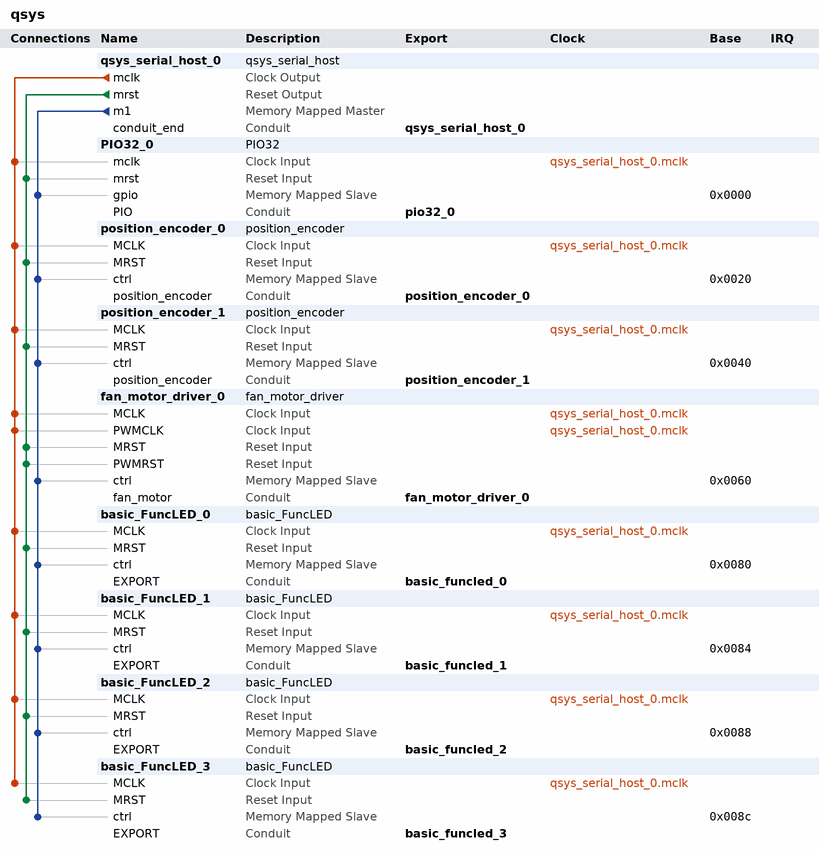
[diagram p0: system contents]
# Platform Designer (Qsys) system qsys, MAX II EPM1270T144C5
# Parameters at their usual value, and those the tool derives, are not listed.
package require qsys
create_system qsys
set_project_property DEVICE_FAMILY {MAX II}
set_project_property DEVICE EPM1270T144C5

add_instance qsys_serial_host_0 qsys_serial_host 1.0
set_instance_parameter_value qsys_serial_host_0 initial_state 0

add_instance PIO32_0 PIO32 1.0

add_instance position_encoder_0 position_encoder 1.0

add_instance position_encoder_1 position_encoder 1.0

add_instance fan_motor_driver_0 fan_motor_driver 1.0

add_instance basic_FuncLED_0 basic_FuncLED 1.0

add_instance basic_FuncLED_1 basic_FuncLED 1.0

add_instance basic_FuncLED_2 basic_FuncLED 1.0

add_instance basic_FuncLED_3 basic_FuncLED 1.0

# connections
add_connection qsys_serial_host_0.mclk basic_FuncLED_0.MCLK clock
add_connection qsys_serial_host_0.mclk basic_FuncLED_1.MCLK clock
add_connection qsys_serial_host_0.mclk basic_FuncLED_2.MCLK clock
add_connection qsys_serial_host_0.mclk basic_FuncLED_3.MCLK clock
add_connection qsys_serial_host_0.mclk fan_motor_driver_0.MCLK clock
add_connection qsys_serial_host_0.mclk fan_motor_driver_0.PWMCLK clock
add_connection qsys_serial_host_0.mclk PIO32_0.mclk clock
add_connection qsys_serial_host_0.mclk position_encoder_0.MCLK clock
add_connection qsys_serial_host_0.mclk position_encoder_1.MCLK clock
add_connection qsys_serial_host_0.mrst basic_FuncLED_0.MRST reset
add_connection qsys_serial_host_0.mrst basic_FuncLED_1.MRST reset
add_connection qsys_serial_host_0.mrst basic_FuncLED_2.MRST reset
add_connection qsys_serial_host_0.mrst basic_FuncLED_3.MRST reset
add_connection qsys_serial_host_0.mrst fan_motor_driver_0.MRST reset
add_connection qsys_serial_host_0.mrst fan_motor_driver_0.PWMRST reset
add_connection qsys_serial_host_0.mrst PIO32_0.mrst reset
add_connection qsys_serial_host_0.mrst position_encoder_0.MRST reset
add_connection qsys_serial_host_0.mrst position_encoder_1.MRST reset
add_connection qsys_serial_host_0.m1 basic_FuncLED_0.ctrl avalon
set_connection_parameter_value qsys_serial_host_0.m1/basic_FuncLED_0.ctrl baseAddress 0x0080
add_connection qsys_serial_host_0.m1 basic_FuncLED_1.ctrl avalon
set_connection_parameter_value qsys_serial_host_0.m1/basic_FuncLED_1.ctrl baseAddress 0x0084
add_connection qsys_serial_host_0.m1 basic_FuncLED_2.ctrl avalon
set_connection_parameter_value qsys_serial_host_0.m1/basic_FuncLED_2.ctrl baseAddress 0x0088
add_connection qsys_serial_host_0.m1 basic_FuncLED_3.ctrl avalon
set_connection_parameter_value qsys_serial_host_0.m1/basic_FuncLED_3.ctrl baseAddress 0x008c
add_connection qsys_serial_host_0.m1 fan_motor_driver_0.ctrl avalon
set_connection_parameter_value qsys_serial_host_0.m1/fan_motor_driver_0.ctrl baseAddress 0x0060
add_connection qsys_serial_host_0.m1 PIO32_0.gpio avalon
set_connection_parameter_value qsys_serial_host_0.m1/PIO32_0.gpio baseAddress 0x0000
add_connection qsys_serial_host_0.m1 position_encoder_0.ctrl avalon
set_connection_parameter_value qsys_serial_host_0.m1/position_encoder_0.ctrl baseAddress 0x0020
add_connection qsys_serial_host_0.m1 position_encoder_1.ctrl avalon
set_connection_parameter_value qsys_serial_host_0.m1/position_encoder_1.ctrl baseAddress 0x0040

# exported interfaces
add_interface qsys_serial_host_0 conduit end
set_interface_property qsys_serial_host_0 EXPORT_OF qsys_serial_host_0.conduit_end
add_interface position_encoder_0 conduit end
set_interface_property position_encoder_0 EXPORT_OF position_encoder_0.position_encoder
add_interface position_encoder_1 conduit end
set_interface_property position_encoder_1 EXPORT_OF position_encoder_1.position_encoder
add_interface fan_motor_driver_0 conduit end
set_interface_property fan_motor_driver_0 EXPORT_OF fan_motor_driver_0.fan_motor
add_interface pio32_0 conduit end
set_interface_property pio32_0 EXPORT_OF PIO32_0.PIO
add_interface basic_funcled_1 conduit end
set_interface_property basic_funcled_1 EXPORT_OF basic_FuncLED_1.EXPORT
add_interface basic_funcled_0 conduit end
set_interface_property basic_funcled_0 EXPORT_OF basic_FuncLED_0.EXPORT
add_interface basic_funcled_2 conduit end
set_interface_property basic_funcled_2 EXPORT_OF basic_FuncLED_2.EXPORT
add_interface basic_funcled_3 conduit end
set_interface_property basic_funcled_3 EXPORT_OF basic_FuncLED_3.EXPORT

save_system qsys.qsys
